# Altium schematic sheet FPGA_Project1.SchDoc
size A4
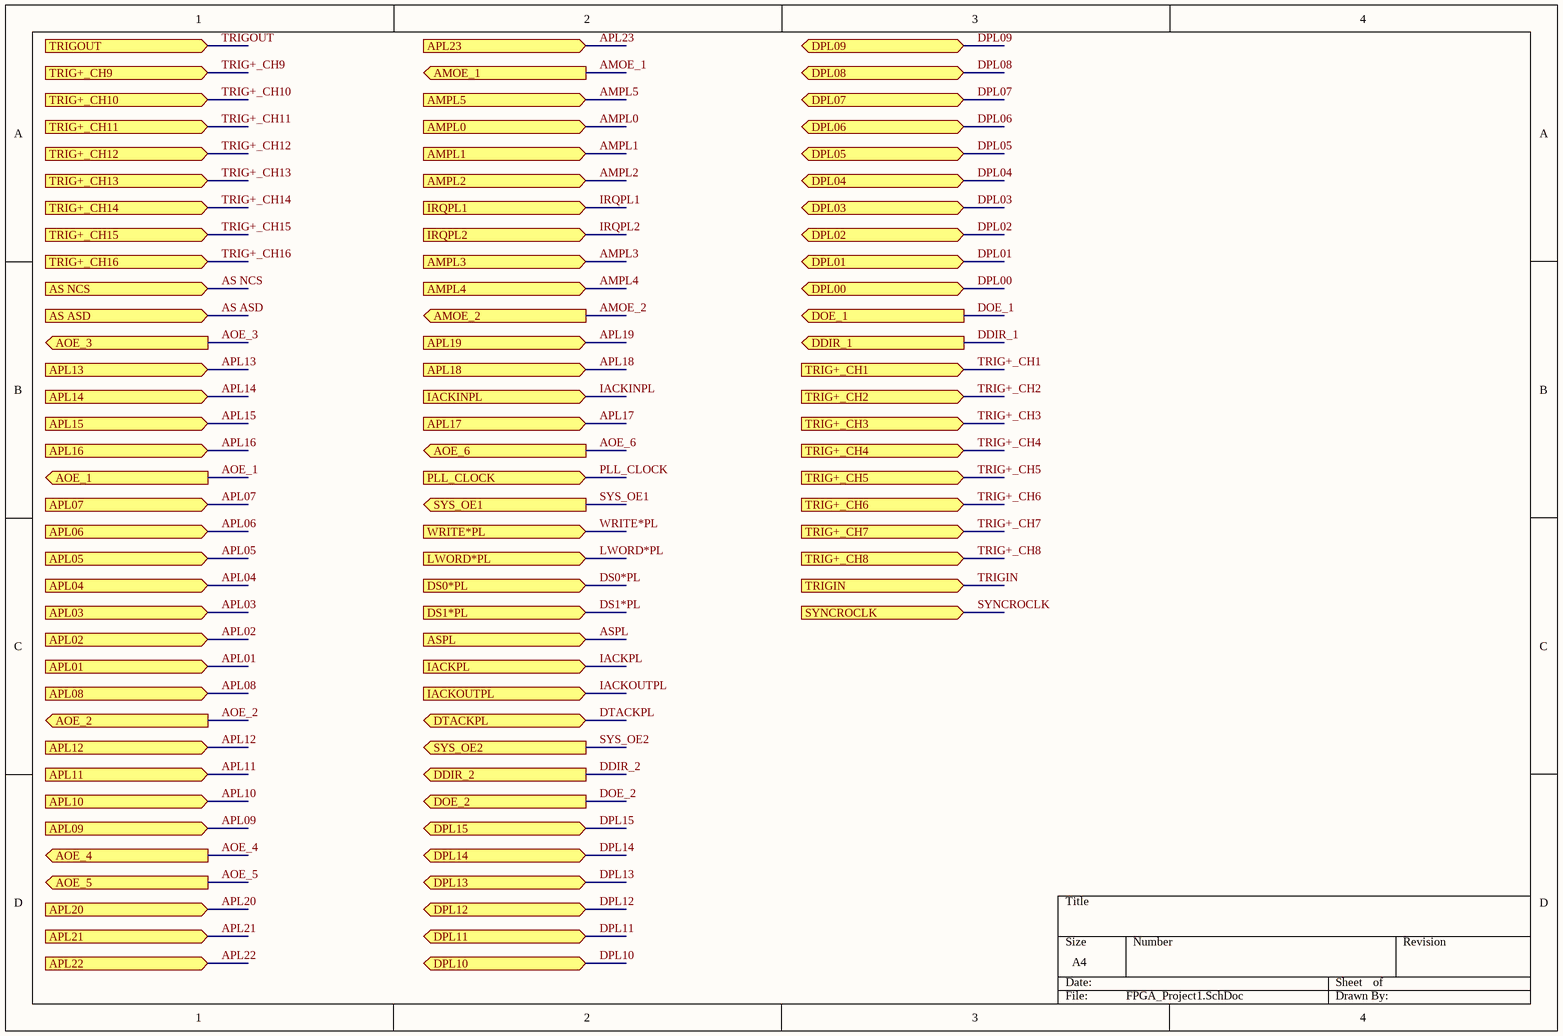
[diagram p0: FPGA_Project1.SchDoc]

## Ports
AMOE_1 (out), AMOE_2 (out), AMPL0 (in), AMPL1 (in), AMPL2 (in), AMPL3 (in), AMPL4 (in), AMPL5 (in), AOE_1 (out), AOE_2 (out), AOE_3 (out), AOE_4 (out), AOE_5 (out), AOE_6 (out), APL01 (in), APL02 (in), APL03 (in), APL04 (in), APL05 (in), APL06 (in), APL07 (in), APL08 (in), APL09 (in), APL10 (in), APL11 (in), APL12 (in), APL13 (in), APL14 (in), APL15 (in), APL16 (in), APL17 (in), APL18 (in), APL19 (in), APL20 (in), APL21 (in), APL22 (in), APL23 (in), AS ASD (in), AS NCS (in), ASPL (in), DDIR_1 (out), DDIR_2 (out), DOE_1 (out), DOE_2 (out), DPL00 (bidir), DPL01 (bidir), DPL02 (bidir), DPL03 (bidir), DPL04 (bidir), DPL05 (bidir), DPL06 (bidir), DPL07 (bidir), DPL08 (bidir), DPL09 (bidir), DPL10 (bidir), DPL11 (bidir), DPL12 (bidir), DPL13 (bidir), DPL14 (bidir), DPL15 (bidir), DS0*PL (in), DS1*PL (in), DTACKPL (bidir), IACKINPL (in), IACKOUTPL (in), IACKPL (in), IRQPL1 (in), IRQPL2 (in), LWORD*PL (in), PLL_CLOCK (in), SYNCROCLK (in), SYS_OE1 (out), SYS_OE2 (out), TRIG+_CH1 (in), TRIG+_CH2 (in), TRIG+_CH3 (in), TRIG+_CH4 (in), TRIG+_CH5 (in), TRIG+_CH6 (in), TRIG+_CH7 (in), TRIG+_CH8 (in), TRIG+_CH9 (in), TRIG+_CH10 (in), TRIG+_CH11 (in), TRIG+_CH12 (in), TRIG+_CH13 (in), TRIG+_CH14 (in), TRIG+_CH15 (in), TRIG+_CH16 (in), TRIGIN (in), TRIGOUT (in), WRITE*PL (in)

## Nets
AMOE_1: port AMOE_1
AMOE_2: port AMOE_2
AMPL0: port AMPL0
AMPL1: port AMPL1
AMPL2: port AMPL2
AMPL3: port AMPL3
AMPL4: port AMPL4
AMPL5: port AMPL5
AOE_1: port AOE_1
AOE_2: port AOE_2
AOE_3: port AOE_3
AOE_4: port AOE_4
AOE_5: port AOE_5
AOE_6: port AOE_6
APL01: port APL01
APL02: port APL02
APL03: port APL03
APL04: port APL04
APL05: port APL05
APL06: port APL06
APL07: port APL07
APL08: port APL08
APL09: port APL09
APL10: port APL10
APL11: port APL11
APL12: port APL12
APL13: port APL13
APL14: port APL14
APL15: port APL15
APL16: port APL16
APL17: port APL17
APL18: port APL18
APL19: port APL19
APL20: port APL20
APL21: port APL21
APL22: port APL22
APL23: port APL23
AS ASD: port AS ASD
AS NCS: port AS NCS
ASPL: port ASPL
DDIR_1: port DDIR_1
DDIR_2: port DDIR_2
DOE_1: port DOE_1
DOE_2: port DOE_2
DPL00: port DPL00
DPL01: port DPL01
DPL02: port DPL02
DPL03: port DPL03
DPL04: port DPL04
DPL05: port DPL05
DPL06: port DPL06
DPL07: port DPL07
DPL08: port DPL08
DPL09: port DPL09
DPL10: port DPL10
DPL11: port DPL11
DPL12: port DPL12
DPL13: port DPL13
DPL14: port DPL14
DPL15: port DPL15
DS0*PL: port DS0*PL
DS1*PL: port DS1*PL
DTACKPL: port DTACKPL
IACKINPL: port IACKINPL
IACKOUTPL: port IACKOUTPL
IACKPL: port IACKPL
IRQPL1: port IRQPL1
IRQPL2: port IRQPL2
LWORD*PL: port LWORD*PL
PLL_CLOCK: port PLL_CLOCK
SYNCROCLK: port SYNCROCLK
SYS_OE1: port SYS_OE1
SYS_OE2: port SYS_OE2
TRIG+_CH1: port TRIG+_CH1
TRIG+_CH2: port TRIG+_CH2
TRIG+_CH3: port TRIG+_CH3
TRIG+_CH4: port TRIG+_CH4
TRIG+_CH5: port TRIG+_CH5
TRIG+_CH6: port TRIG+_CH6
TRIG+_CH7: port TRIG+_CH7
TRIG+_CH8: port TRIG+_CH8
TRIG+_CH9: port TRIG+_CH9
TRIG+_CH10: port TRIG+_CH10
TRIG+_CH11: port TRIG+_CH11
TRIG+_CH12: port TRIG+_CH12
TRIG+_CH13: port TRIG+_CH13
TRIG+_CH14: port TRIG+_CH14
TRIG+_CH15: port TRIG+_CH15
TRIG+_CH16: port TRIG+_CH16
TRIGIN: port TRIGIN
TRIGOUT: port TRIGOUT
WRITE*PL: port WRITE*PL